# EAGLE schematic 1 (EAGLE 6.4)
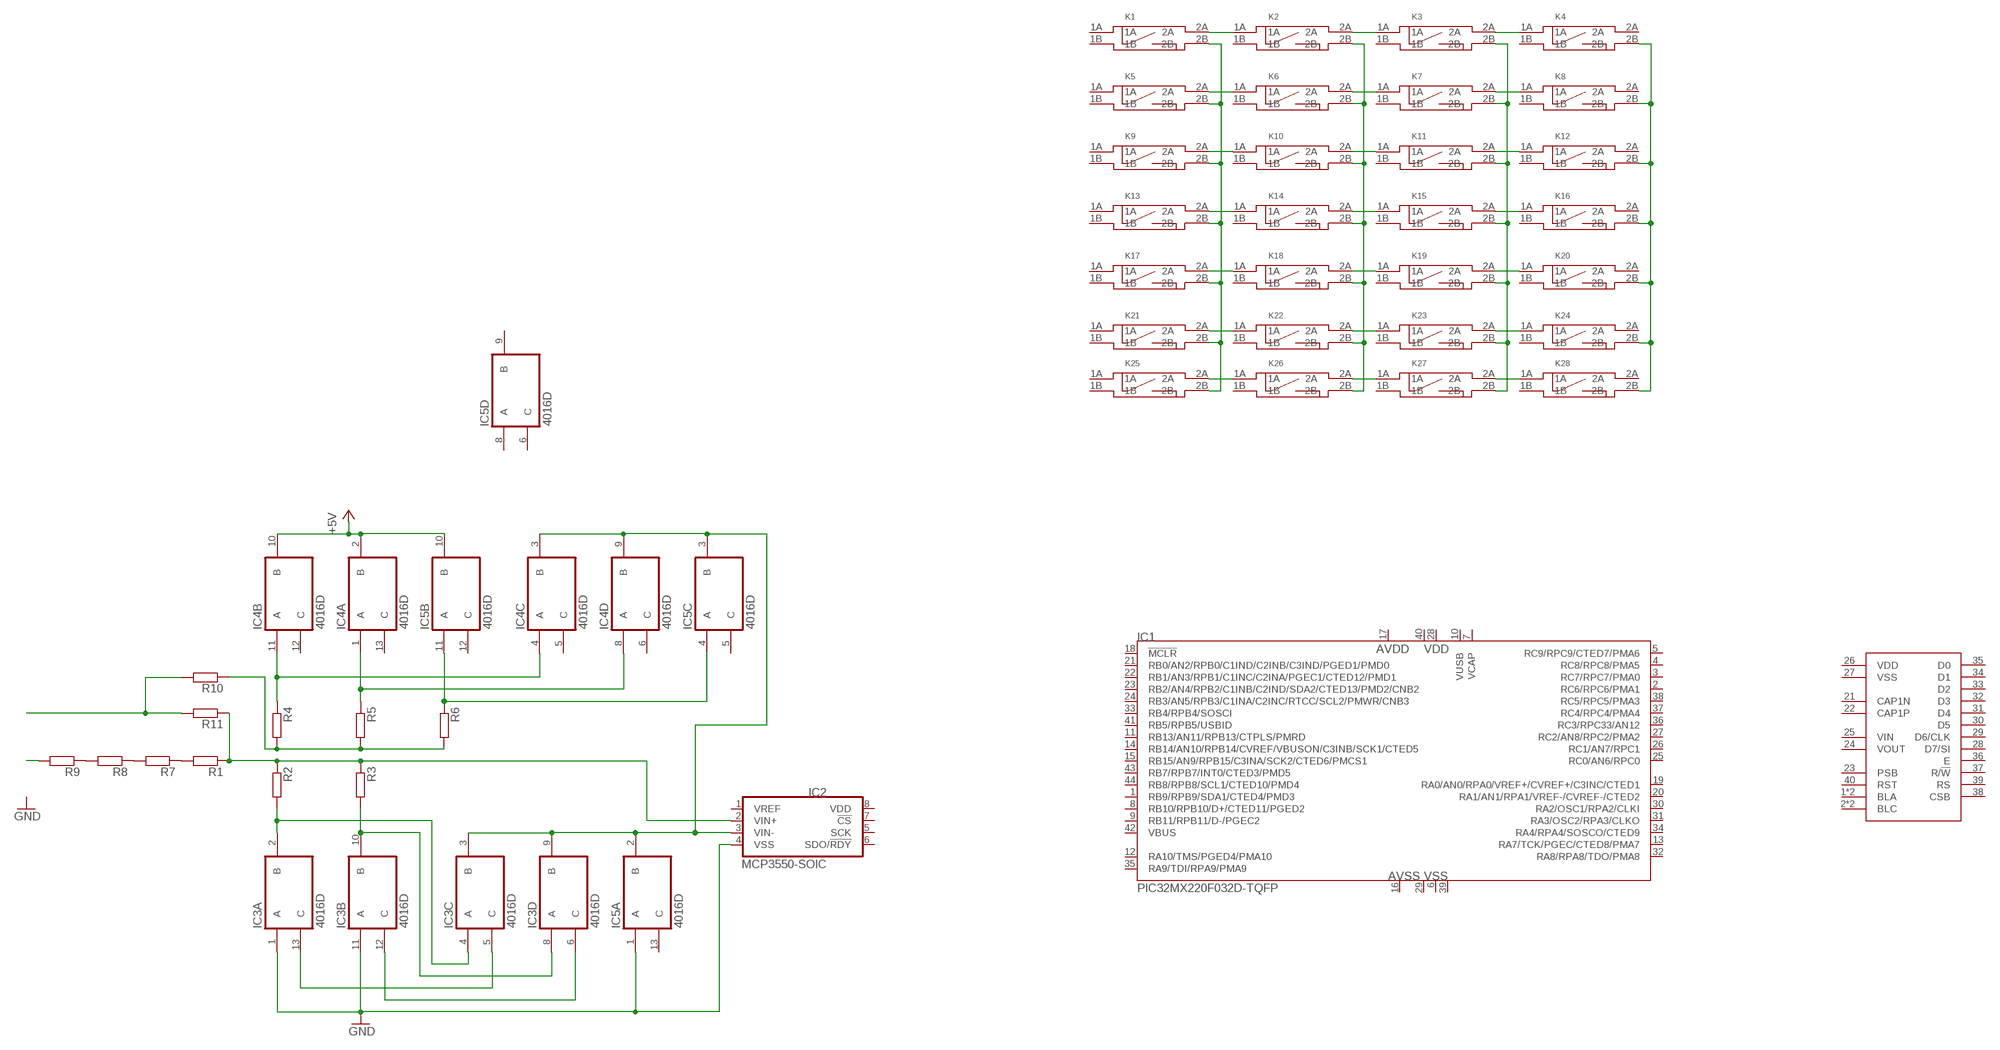
[diagram p0: schematic, sheet 1]

## Parts
IC1  PIC32MX220F032D-TQFP  [TQFP44]
IC2  MCP3550-SOIC  [SO-08]
IC3  4016D  [SO14]
IC4  4016D  [SO14]
IC5  4016D  [SO14]
K1  SWITCH_BD_B  [SW_SMD2]
K2  SWITCH_BD_B  [SW_SMD2]
K3  SWITCH_BD_B  [SW_SMD2]
K4  SWITCH_BD_B  [SW_SMD2]
K5  SWITCH_BD_B  [SW_SMD2]
K6  SWITCH_BD_B  [SW_SMD2]
K7  SWITCH_BD_B  [SW_SMD2]
K8  SWITCH_BD_B  [SW_SMD2]
K9  SWITCH_BD_B  [SW_SMD2]
K10  SWITCH_BD_B  [SW_SMD2]
K11  SWITCH_BD_B  [SW_SMD2]
K12  SWITCH_BD_B  [SW_SMD2]
K13  SWITCH_BD_B  [SW_SMD2]
K14  SWITCH_BD_B  [SW_SMD2]
K15  SWITCH_BD_B  [SW_SMD2]
K16  SWITCH_BD_B  [SW_SMD2]
K17  SWITCH_BD_B  [SW_SMD2]
K18  SWITCH_BD_B  [SW_SMD2]
K19  SWITCH_BD_B  [SW_SMD2]
K20  SWITCH_BD_B  [SW_SMD2]
K21  SWITCH_BD_B  [SW_SMD2]
K22  SWITCH_BD_B  [SW_SMD2]
K23  SWITCH_BD_B  [SW_SMD2]
K24  SWITCH_BD_B  [SW_SMD2]
K25  SWITCH_BD_B  [SW_SMD2]
K26  SWITCH_BD_B  [SW_SMD2]
K27  SWITCH_BD_B  [SW_SMD2]
K28  SWITCH_BD_B  [SW_SMD2]
LCD  EAGOG_M  [EADOGM]
R1  R_1206  [R1206]
R2  R_1206  [R1206]
R3  R_1206  [R1206]
R4  R_1206  [R1206]
R5  R_1206  [R1206]
R6  R_1206  [R1206]
R7  R_1206  [R1206]
R8  R_1206  [R1206]
R9  R_1206  [R1206]
R10  R_1206  [R1206]
R11  R_1206  [R1206]

## Nets
+5V: IC4.2(A:B) IC4.10(B:B) IC5.10(B:B)
GND: IC2.4(VSS) IC3.1(A:A) IC3.11(B:A) IC5.1(A:A)
N$1: K25.2A K26.1A
N$2: K26.2A K27.1A
N$3: K27.2A K28.1A
N$4: K21.2A K22.1A
N$5: K22.2A K23.1A
N$6: K23.2A K24.1A
N$7: K19.2A K20.1A
N$8: K18.2A K19.1A
N$9: K17.2A K18.1A
N$10: K13.2A K14.1A
N$11: K14.2A K15.1A
N$12: K15.2A K16.1A
N$13: K11.2A K12.1A
N$14: K10.2A K11.1A
N$15: K9.2A K10.1A
N$16: K5.2A K6.1A
N$17: K6.2A K7.1A
N$18: K7.2A K8.1A
N$19: K1.2A K2.1A
N$20: K2.2A K3.1A
N$21: K3.2A K4.1A
N$22: K1.2B K5.2B K9.2B K13.2B K17.2B K21.2B K25.2B
N$23: K2.2B K6.2B K10.2B K14.2B K18.2B K22.2B K26.2B
N$24: K3.2B K7.2B K11.2B K15.2B K19.2B K23.2B K27.2B
N$25: K4.2B K8.2B K12.2B K16.2B K20.2B K24.2B K28.2B
N$27: IC3.2(A:B) IC3.4(C:A) R2.2
N$28: IC3.8(D:A) IC3.10(B:B) R3.2
N$29: IC2.3(VIN-) IC3.3(C:B) IC3.9(D:B) IC4.3(C:B) IC4.9(D:B) IC5.2(A:B) IC5.3(C:B)
N$30: R4.2 R5.2 R6.2 R10.1
N$31: IC4.4(C:A) IC4.11(B:A) R4.1
N$32: IC4.1(A:A) IC4.8(D:A) R5.1
N$33: R1.2 R7.1
N$34: IC2.2(VIN+) R1.1 R2.1 R3.1 R11.1
N$35: R10.2 R11.2
N$36: R7.2 R8.1
N$37: IC5.4(C:A) IC5.11(B:A) R6.1
N$38: R8.2 R9.1
N$40: R9.2
N$41: IC3.5(C:C) IC3.13(A:C)
N$42: IC3.6(D:C) IC3.12(B:C)
Unconnected: IC1.1(RB9/RPB9/SDA1/CTED4/PMD3) IC1.2(RC6/RPC6/PMA1) IC1.3(RC7/RPC7/PMA0) IC1.4(RC8/RPC8/PMA5) IC1.5(RC9/RPC9/CTED7/PMA6) IC1.7(VCAP) IC1.8(RB10/RPB10/D+/CTED11/PGED2) IC1.9(RB11/RPB11/D-/PGEC2) IC1.10(VUSB) IC1.11(RB13/AN11/RPB13/CTPLS/PMRD) IC1.12(RA10/TMS/PGED4/PMA10) IC1.13(RA7/TCK/PGEC/CTED8/PMA7) IC1.14(RB14/AN10/RPB14/CVREF/VBUSON/C3INB/SCK1/CTED5) IC1.15(RB15/AN9/RPB15/C3INA/SCK2/CTED6/PMCS1) IC1.18(!MCLR) IC1.19(RA0/AN0/RPA0/VREF+/CVREF+/C3INC/CTED1) IC1.20(RA1/AN1/RPA1/VREF-/CVREF-/CTED2) IC1.21(RB0/AN2/RPB0/C1IND/C2INB/C3IND/PGED1/PMD0) IC1.22(RB1/AN3/RPB1/C1INC/C2INA/PGEC1/CTED12/PMD1) IC1.23(RB2/AN4/RPB2/C1INB/C2IND/SDA2/CTED13/PMD2/CNB2) IC1.24(RB3/AN5/RPB3/C1INA/C2INC/RTCC/SCL2/PMWR/CNB3) IC1.25(RC0/AN6/RPC0) IC1.26(RC1/AN7/RPC1) IC1.27(RC2/AN8/RPC2/PMA2) IC1.30(RA2/OSC1/RPA2/CLKI) IC1.31(RA3/OSC2/RPA3/CLKO) IC1.32(RA8/RPA8/TDO/PMA8) IC1.33(RB4/RPB4/SOSCI) IC1.34(RA4/RPA4/SOSCO/CTED9) IC1.35(RA9/TDI/RPA9/PMA9) IC1.36(RC3/RPC33/AN12) IC1.37(RC4/RPC4/PMA4) IC1.38(RC5/RPC5/PMA3) IC1.41(RB5/RPB5/USBID) IC1.42(VBUS) IC1.43(RB7/RPB7/INT0/CTED3/PMD5) IC1.44(RB8/RPB8/SCL1/CTED10/PMD4) IC2.1(VREF) IC2.5(SCK) IC2.6(SDO/!RDY) IC2.7(!CS) IC4.5(C:C) IC4.6(D:C) IC4.12(B:C) IC4.13(A:C) IC5.5(C:C) IC5.6(D:C) IC5.8(D:A) IC5.9(D:B) IC5.12(B:C) IC5.13(A:C) K1.1A K1.1B K2.1B K3.1B K4.1B K4.2A K5.1A K5.1B K6.1B K7.1B K8.1B K8.2A K9.1A K9.1B K10.1B K11.1B K12.1B K12.2A K13.1A K13.1B K14.1B K15.1B K16.1B K16.2A K17.1A K17.1B K18.1B K19.1B K20.1B K20.2A K21.1A K21.1B K22.1B K23.1B K24.1B K24.2A K25.1A K25.1B K26.1B K27.1B K28.1B K28.2A LCD.1(BLA) LCD.2(BLC) LCD.19(BLC) LCD.20(BLA) LCD.21(CAP1N) LCD.22(CAP1P) LCD.23(PSB) LCD.24(VOUT) LCD.25(VIN) LCD.26(VDD) LCD.27(VSS) LCD.28(D7/SI) LCD.29(D6/CLK) LCD.30(D5) LCD.31(D4) LCD.32(D3) LCD.33(D2) LCD.34(D1) LCD.35(D0) LCD.36(E) LCD.37(R/!W) LCD.38(CSB) LCD.39(RS) LCD.40(RST)

## Power pins joined to a net without a drawn wire
AVDD: IC1.17(AVDD)
AVSS: IC1.16(AVSS)
VDD: IC1.40(VDD) IC2.8(VDD) IC3.14(P:VDD) IC4.14(P:VDD) IC5.14(P:VDD)
VDD2: IC1.28(VDD2)
VSS: IC1.29(VSS) IC3.7(P:VSS) IC4.7(P:VSS) IC5.7(P:VSS)
VSS1: IC1.6(VSS1)
VSS2: IC1.39(VSS2)

## Library data of the parts
IC1 = _mcom5:PIC32MX220F032D
IC2 = _mcom5:MCP3550
IC3-IC5 = 40xx:4016: Quad bilateral ANALOG SWITCH
K1-K28 = _moja:SWITCH_BD
LCD = _mcom5:EAGOG_M
R1-R11 = _moja:R